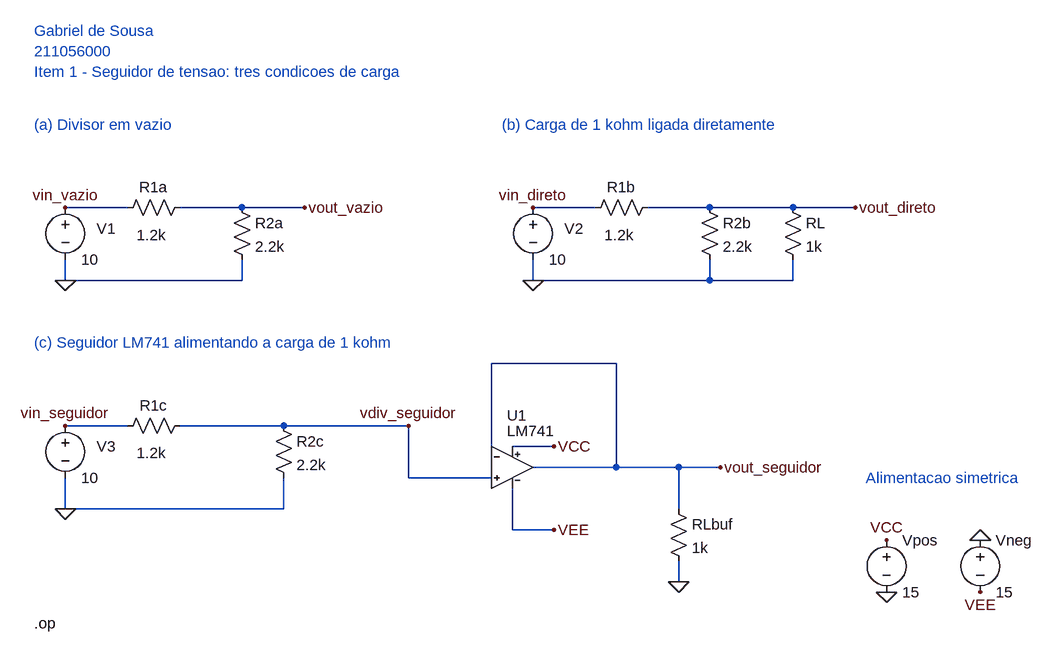
[diagram p0: schematic item_1.asc]
item_1.asc, the LTspice schematic file:
Version 4.1
SHEET 1 1800 950
WIRE 112 224 208 224
WIRE 288 224 384 224
WIRE 384 224 480 224
WIRE 112 304 112 336
WIRE 384 304 384 336
WIRE 112 336 384 336
WIRE 832 224 928 224
WIRE 1008 224 1104 224
WIRE 1104 224 1232 224
WIRE 1232 224 1328 224
WIRE 832 304 832 336
WIRE 1104 304 1104 336
WIRE 1232 304 1232 336
WIRE 832 336 1232 336
WIRE 112 560 208 560
WIRE 288 560 448 560
WIRE 448 560 640 560
WIRE 640 560 640 640
WIRE 640 640 768 640
WIRE 448 640 448 688
WIRE 112 640 112 688
WIRE 112 688 448 688
WIRE 768 464 768 608
WIRE 768 464 960 464
WIRE 960 464 960 624
WIRE 960 624 832 624
WIRE 960 624 1120 624
WIRE 1056 624 1056 688
WIRE 1056 768 1056 800
WIRE 800 592 864 592
WIRE 800 656 800 720
WIRE 800 720 864 720
FLAG 112 336 0
FLAG 112 224 vin_vazio
FLAG 480 224 vout_vazio
FLAG 832 336 0
FLAG 832 224 vin_direto
FLAG 1328 224 vout_direto
FLAG 112 688 0
FLAG 112 560 vin_seguidor
FLAG 640 560 vdiv_seguidor
FLAG 1120 624 vout_seguidor
FLAG 1056 800 0
FLAG 864 592 VCC
FLAG 864 720 VEE
FLAG 1376 736 VCC
FLAG 1376 816 0
FLAG 1520 736 0
FLAG 1520 816 VEE
SYMBOL voltage 112 208 R0
WINDOW 0 48 48 Left 2
SYMATTR InstName V1
SYMATTR Value 10
SYMBOL res 304 208 R90
WINDOW 0 0 56 VBottom 2
WINDOW 3 58 59 VCenter 2
SYMATTR InstName R1a
SYMATTR Value 1.2k
SYMBOL res 368 208 R0
SYMATTR InstName R2a
SYMATTR Value 2.2k
SYMBOL voltage 832 208 R0
WINDOW 0 48 48 Left 2
SYMATTR InstName V2
SYMATTR Value 10
SYMBOL res 1024 208 R90
WINDOW 0 0 56 VBottom 2
WINDOW 3 58 59 VCenter 2
SYMATTR InstName R1b
SYMATTR Value 1.2k
SYMBOL res 1088 208 R0
SYMATTR InstName R2b
SYMATTR Value 2.2k
SYMBOL res 1216 208 R0
SYMATTR InstName RL
SYMATTR Value 1k
SYMBOL voltage 112 544 R0
WINDOW 0 48 48 Left 2
SYMATTR InstName V3
SYMATTR Value 10
SYMBOL res 304 544 R90
WINDOW 0 0 56 VBottom 2
WINDOW 3 58 59 VCenter 2
SYMATTR InstName R1c
SYMATTR Value 1.2k
SYMBOL res 432 544 R0
SYMATTR InstName R2c
SYMATTR Value 2.2k
SYMBOL item_6 800 560 R0
WINDOW 0 -8 -16 Left 2
WINDOW 3 -8 8 Left 2
SYMATTR InstName U1
SYMBOL res 1040 672 R0
SYMATTR InstName RLbuf
SYMATTR Value 1k
SYMBOL voltage 1376 720 R0
SYMATTR InstName Vpos
SYMATTR Value 15
SYMBOL voltage 1520 720 R0
SYMATTR InstName Vneg
SYMATTR Value 15
TEXT 64 -48 Left 2 ;Gabriel de Sousa\n211056000\nItem 1 - Seguidor de tensao: tres condicoes de carga
TEXT 64 96 Left 2 ;(a) Divisor em vazio
TEXT 784 96 Left 2 ;(b) Carga de 1 kohm ligada diretamente
TEXT 64 432 Left 2 ;(c) Seguidor LM741 alimentando a carga de 1 kohm
TEXT 1344 640 Left 2 ;Alimentacao simetrica
TEXT 64 864 Left 2 !.op

The netlist it stands for:
* item_1.asc
V1 vin_vazio 0 10
R1a vout_vazio vin_vazio 1.2k
R2a vout_vazio 0 2.2k
V2 vin_direto 0 10
R1b vout_direto vin_direto 1.2k
R2b vout_direto 0 2.2k
RL vout_direto 0 1k
V3 vin_seguidor 0 10
R1c vdiv_seguidor vin_seguidor 1.2k
R2c vdiv_seguidor 0 2.2k
X§U1 vdiv_seguidor vout_seguidor VCC VEE vout_seguidor LM741  ; pins In+ In- V+ V- OUT
RLbuf vout_seguidor 0 1k
Vpos VCC 0 15
Vneg 0 VEE 15
* Gabriel de Sousa
* 211056000
* Item 1 - Seguidor de tensao: tres condicoes de carga
* (a) Divisor em vazio
* (b) Carga de 1 kohm ligada diretamente
* (c) Seguidor LM741 alimentando a carga de 1 kohm
* Alimentacao simetrica
.op
.lib ene0046.lib
.backanno
.end